# EAGLE design Hardware_v3 (EAGLE 9.3.1)
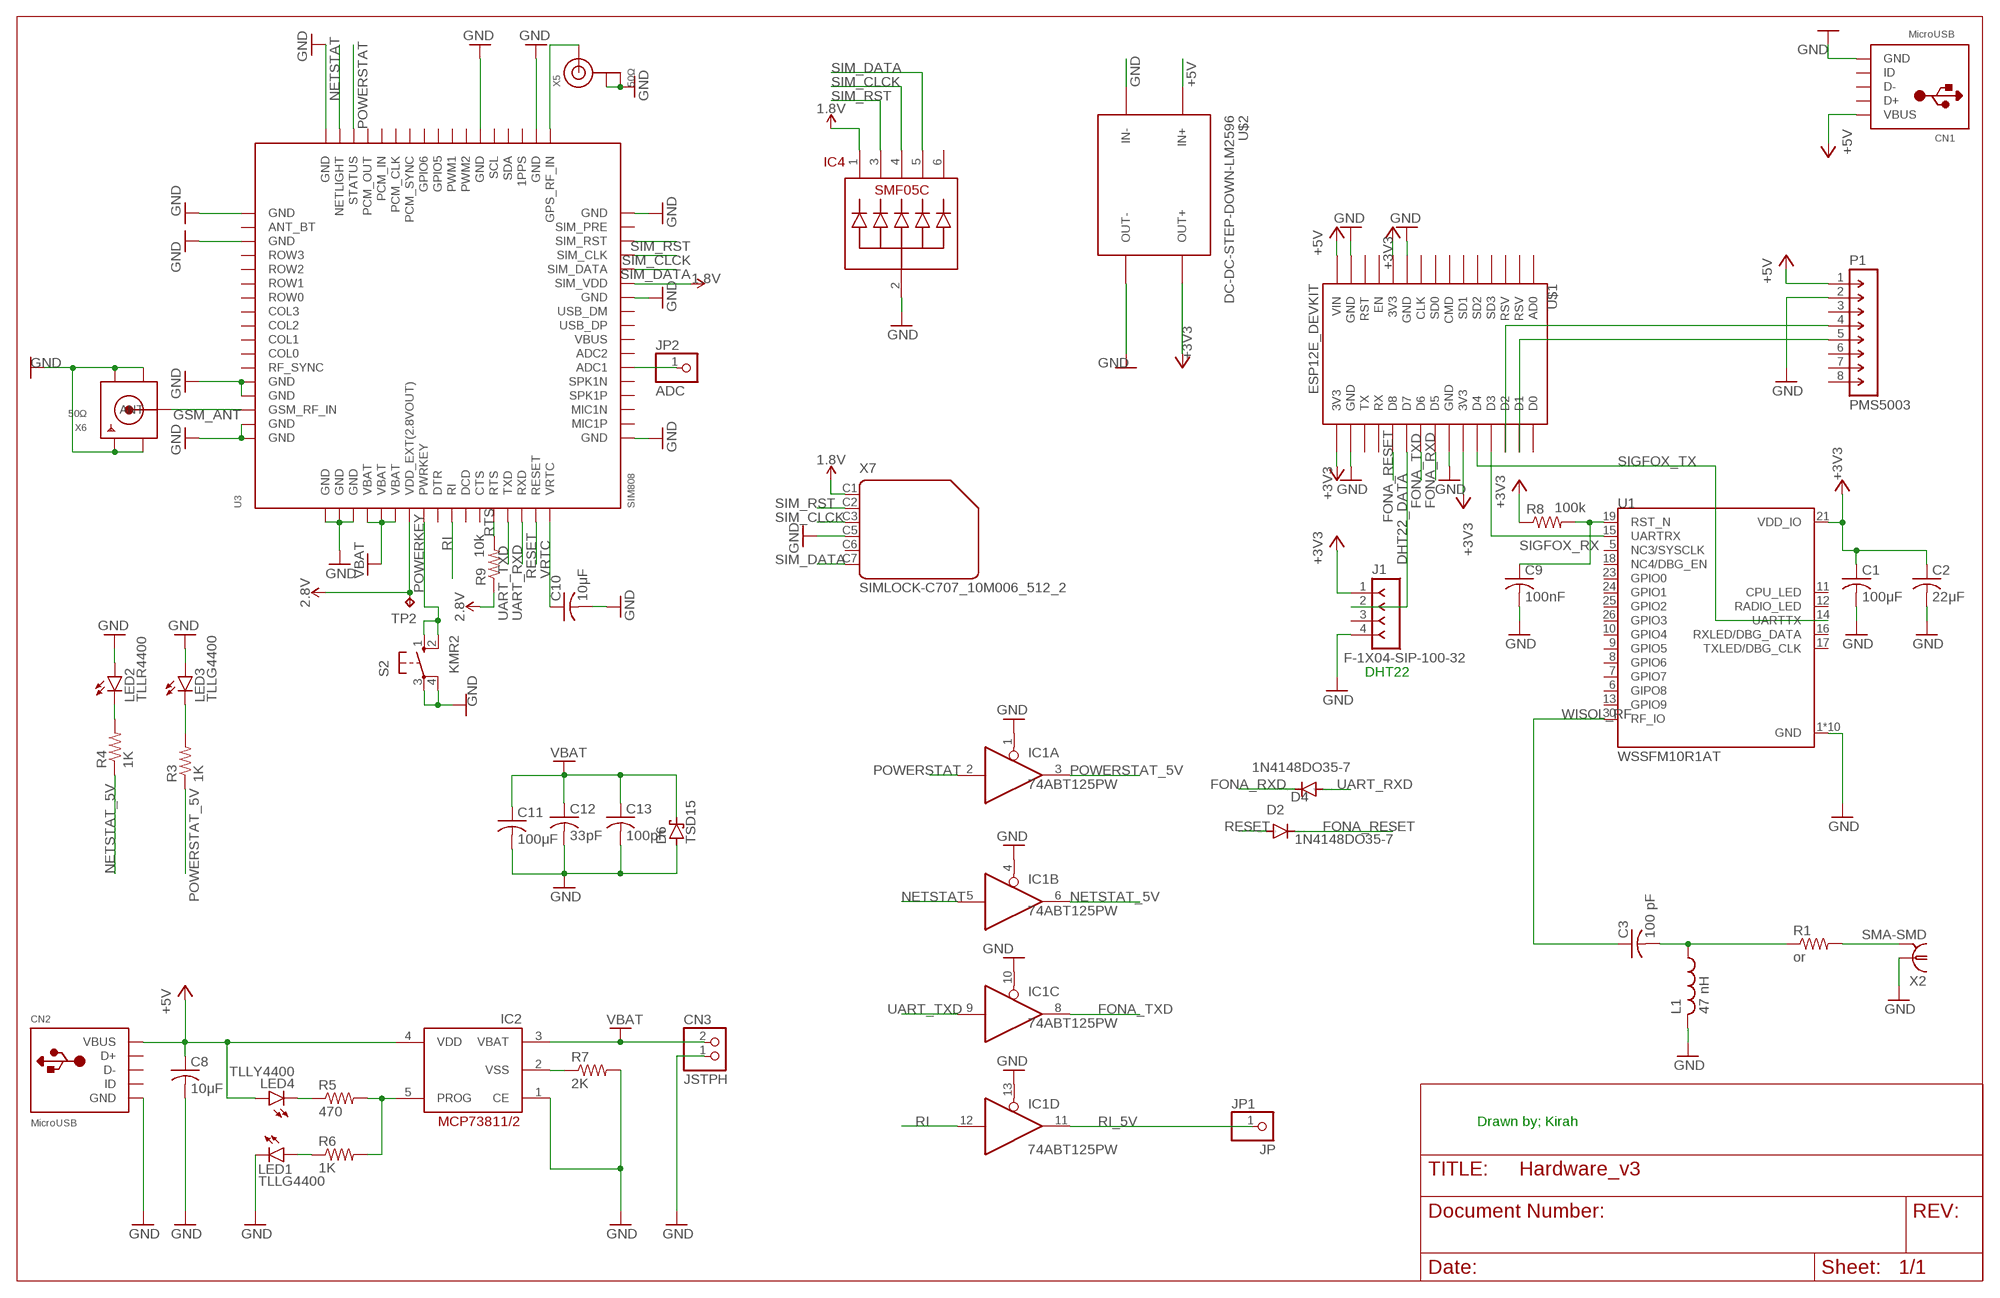
[diagram p0: schematic, sheet 1]

## Parts
C1  100μF  C-USC0201  [C0201]
C2  22μF  C-USC0201  [C0201]
C3  100 pF  C-USC0201  [C0201]
C8  10μF  C-US025-025X050  [C025-025X050]
C9  100nF  C-US025-025X050  [C025-025X050]
C10  10μF  C-USC0402  [C0402]
C11  100μF  C-USC0402  [C0402]
C12  33pF  C-USC0402  [C0402]
C13  100pF  C-USC0402  [C0402]
CN1  MicroUSB  USBMINIB  [USB-MINIB]
CN2  MicroUSB  USBMINIB  [USB-MINIB]
CN3  JSTPH  JST_2PIN-SMT  [JST-PH-2-SMT]
D2  1N4148DO35-7  [DO35-7]
D4  1N4148DO35-7  [DO35-7]
D6  TSD15  [CB429-15]
IC1  74ABT125PW  [TSSOP14]
IC2  MCP73811/2  [SOT23-5L]
IC4  SMF05C  [SC-70-6]
J1  F-1X04-SIP-100-32  [SIP-100-04-32]
JP1  JP  PINHD-1X1CB  [1X01-CLEANBIG]
JP2  ADC  PINHD-1X01_2.00  [1X01M]
L1  47 nH  L-US0204/7  [0204/7]
LED1  TLLG4400  [LED3MM]
LED2  TLLR4400  [LED3MM]
LED3  TLLG4400  [LED3MM]
LED4  TLLY4400  [LED3MM]
P1  PMS5003  M-1X08-SIP-100-40  [SIP-100-08-40]
R1  or  R-US_0204/5  [0204/5]
R3  1K  R-US_0204/5  [0204/5]
R4  1K  R-US_0204/5  [0204/5]
R5  470  R-US_0204/5  [0204/5]
R6  1K  R-US_0204/5  [0204/5]
R7  2K  R-US_0204/5  [0204/5]
R8  100k  R-US_0204/7  [0204/7]
R9  10k  R-US_0204/5  [0204/5]
S2  KMR2  40/XX  [B3F/40XX]
TP2  TPTP10R  [TP10R]
U1  WSSFM10R1AT  [XCVR_WSSFM10R1AT]
U3  SIM808  GSM_SIM808_LITERAL  [SIM900_SMT]
U$1  ESP12E_DEVKIT  [ESP12E_DEVKIT]
U$2  DC-DC-STEP-DOWN-LM2596  [DC-DC-STEP-DOWN-LM2596]
X2  SMA-SMD  [SMA-SMD]
X5  50Ω  ANTENNA_U.FL  [U.FL]
X6  50Ω  SMACONNECTOR_EDGE_UFL  [SMA_EDGELAUNCH_UFL]
X7  SIMLOCK-C707_10M006_512_2  [C707_10M006_512_2]

## Nets
1.8V [POWER]: IC4.1 U3.P$29(SIM_VDD) X7.C1
2.8V [POWER]: R9.1 TP2.TP U3.P$7(VDD_EXT(2.8VOUT))
+3V3 [POWER]: C1.1 C2.1 J1.1 R8.1 U1.21(VDD_IO) U$1.3V3@0(3V3) U$1.3V3@1(3V3) U$1.3V3@2(3V3) U$2.OUT+
+5V [POWER]: C8.1 CN1.VBUS CN2.VBUS IC2.4(VDD) LED4.A P1.1 U$1.VIN U$2.IN+
DHT22_DATA: J1.2 U$1.D7
FONA_RESET: D2.C U$1.D8
FONA_RXD: D4.C U$1.D5
FONA_TXD: IC1.8(C:O) U$1.D6
GND [GND]: C1.2 C2.2 C8.2 C9.2 C10.2 C11.2 C12.2 C13.2 CN1.GND CN2.GND CN3.1 D6.A IC1.1(A:OE) IC1.4(B:OE) IC1.10(C:OE) IC1.13(D:OE) IC2.1(CE) IC4.2 J1.4 L1.2 LED1.K(C) LED2.A LED3.A P1.2 R7.2 S2.3(P) S2.4(P1) U1.1(GND) U1.2(GND) U1.3(GND) U1.4(GND) U1.20(GND) U1.22(GND) U1.27(GND) U1.28(GND) U1.29(GND) U1.31(GND) U3.P$1(GND) U3.P$2(GND) U3.P$3(GND) U3.P$18(GND) U3.P$28(GND) U3.P$34(GND) U3.P$36(GND) U3.P$40(GND) U3.P$51(GND) U3.P$52(GND) U3.P$54(GND) U3.P$64(GND) U3.P$65(GND) U3.P$67(GND) U3.P$68(GND) U$1.GND@0(GND) U$1.GND@1(GND) U$1.GND@2(GND) U$1.GND@3(GND) U$2.IN- U$2.OUT- X2.1 X5.1(GND) X5.2(GND) X6.GND@1(GND1) X6.GND@2(GND2) X6.GND@3(GND3) X6.GND@4(GND4) X7.C5
GSM_ANT: U3.P$66(GSM_RF_IN) X6.P(ANT)
N$2: C9.1 R8.2 U1.19(RST_N)
N$3: P1.4 U$1.D2
N$4: P1.5 U$1.D1
N$5: C3.2 L1.1 R1.1
N$6: U3.P$35(GPS_RF_IN) X5.3(SIGNAL)
N$12: R1.2 X2.2@1 X2.2@2 X2.2@3 X2.2@4 X2.2@5 X2.2@6
N$13: JP2.1 U3.P$23(ADC1)
N$18: LED2.K(C) R4.2
N$21: LED3.K(C) R3.2
N$35: LED4.K(C) R5.1
N$36: IC2.5(PROG) R5.2 R6.2
N$37: LED1.A R6.1
NETSTAT: IC1.5(B:I) U3.P$50(NETLIGHT)
NETSTAT_5V: IC1.6(B:O) R4.1
POWERKEY: S2.1(S) S2.2(S1) U3.P$8(PWRKEY)
POWERSTAT: IC1.2(A:I) U3.P$49(STATUS)
POWERSTAT_5V: IC1.3(A:O) R3.1
RESET: D2.A U3.P$16(RESET)
RI: IC1.12(D:I) U3.P$10(RI)
RI_5V: IC1.11(D:O) JP1.1
RTS: R9.2 U3.P$13(RTS)
SIGFOX_RX: U1.15(UARTRX) U$1.D3
SIGFOX_TX: U1.14(UARTTX) U$1.D4
SIM_CLCK: IC4.4 U3.P$31(SIM_CLK) X7.C3
SIM_DATA: IC4.5 U3.P$30(SIM_DATA) X7.C7
SIM_RST: IC4.3 U3.P$32(SIM_RST) X7.C2
UART_RXD: D4.A U3.P$15(RXD)
UART_TXD: IC1.9(C:I) U3.P$14(TXD)
VBAT: C11.1 C12.1 C13.1 CN3.2 D6.C IC2.3(VBAT) U3.P$4(VBAT) U3.P$5(VBAT) U3.P$6(VBAT)
VRTC: C10.1 U3.P$17(VRTC)
VSS: IC2.2(VSS) R7.1
WISOL_RF: C3.1 U1.30(RF_IO)
Unconnected: CN1.D+ CN1.D- CN1.ID CN2.D+ CN2.D- CN2.ID IC4.6 J1.3 P1.3 P1.6 P1.7 P1.8 U1.5(NC3/SYSCLK) U1.6(GIPO8) U1.7(GPIO7) U1.8(GPIO6) U1.9(GPIO5) U1.10(GPIO4) U1.11(CPU_LED) U1.12(RADIO_LED) U1.13(GPIO9) U1.16(RXLED/DBG_DATA) U1.17(TXLED/DBG_CLK) U1.18(NC4/DBG_EN) U1.23(GPIO0) U1.24(GPIO1) U1.25(GPIO2) U1.26(GPIO3) U3.P$9(DTR) U3.P$11(DCD) U3.P$12(CTS) U3.P$19(MIC1P) U3.P$20(MIC1N) U3.P$21(SPK1P) U3.P$22(SPK1N) U3.P$24(ADC2) U3.P$26(USB_DP) U3.P$27(USB_DM) U3.P$33(SIM_PRE) U3.P$37(1PPS) U3.P$38(SDA) U3.P$39(SCL) U3.P$41(PWM2) U3.P$42(PWM1) U3.P$43(GPIO5) U3.P$44(GPIO6) U3.P$45(PCM_SYNC) U3.P$46(PCM_CLK) U3.P$47(PCM_IN) U3.P$48(PCM_OUT) U3.P$53(ANT_BT) U3.P$55(ROW3) U3.P$56(ROW2) U3.P$57(ROW1) U3.P$58(ROW0) U3.P$59(COL3) U3.P$60(COL2) U3.P$61(COL1) U3.P$62(COL0) U3.P$63(RF_SYNC) U$1.AD0 U$1.CLK U$1.CMD U$1.D0 U$1.EN U$1.RST U$1.RSV@0(RSV) U$1.RSV@1(RSV) U$1.RX U$1.SD0 U$1.SD1 U$1.SD2 U$1.SD3 U$1.TX X7.C6

## Notes on the sheet
- DHT22
- Drawn by; Kirah

## Power pins joined to a net without a drawn wire
GND: IC1.7(P:GND)
VBUS: U3.P$25(VBUS)
VCC: IC1.14(P:VCC)

## Library data of the parts
C1-C3 C9-C13 = rcl:C-US: CAPACITOR, American symbol; SPICEPREFIX: C
C8 = adafruit@1:C-US: CAPACITOR, American symbol
CN1 = adafruit:USB: USB Connectors USBMINIB - Surface Mount Female Mini-B USB Connector 4UConnector: 06564 By microbuilder.eu Thru-hole RA Female Mini-B USB Connector 4UConnector: 18732 By ladyada.net
CN2 = adafruit@1:USB: USB Connectors USBMINIB - Surface Mount Female Mini-B USB Connector 4UConnector: 06564 By microbuilder.eu Thru-hole RA Female Mini-B USB Connector 4UConnector: 18732 By ladyada.net
CN3 = adafruit:JST_2PIN: JST 2-Pin Connectors of various flavors SMT-RA (S2B-PH-SM4) 4UConnector #17311 SMT (B2B-PH-SM4) THM-RA (S2B-PH) THM (B2B-PH)
D2 D4 = diode:1N4148: DIODE high speed (Philips)
D6 = diode:TSD15: DIODE
IC1 = 74xx-eu:74*125: Quad bus BUFFER, 3-state
IC2 = adafruit:MCP73811/2: MCP73811 and MCP73812 Simple, Miniature Single-Cell, Fully Integrated Li-Ion / Li-Polymer Charge Management Controllers SOT-23-5 package, no indicator LED but with adjustable current, small and very inexpensive
IC4 = smf05c:SMF05C
J1 = con-headers-jp:F-1X04-: FEMALE HEADER
JP1 = adafruit:PINHD-1X1: Pin header 1x1 for 0.1" spacing With round pins
JP2 = pinhead-2:PINHD-1X01: PIN HEADER
L1 = rcl:L-US: INDUCTOR, American symbol; SPICEPREFIX: L
LED1 LED3 = led:TLLG4400: Low Current (2mA) LED 3 mm Tinted Diffused Package color GREEN Source: Data sheet <http://www.farnell.com/datasheets/391098.pdf>; MF: VISHAY SEMICONDUCTOR; OC_FARNELL: 1612435
LED2 = led:TLLR4400: Low Current (2mA) LED 3 mm Tinted Diffused Package color RED Source: Data sheet <http://www.farnell.com/datasheets/391100.pdf>; MF: VISHAY SEMICONDUCTOR; OC_FARNELL: 1612437
LED4 = led:TLLY4400: Low Current (2mA) LED 3 mm Tinted Diffused Package color YELLOW Source: Data sheet <http://www.farnell.com/datasheets/391098.pdf>; MF: VISHAY SEMICONDUCTOR; OC_FARNELL: 1612439
P1 = con-headers-jp:M-1X08-: MALE HEADER
R1 R3-R9 = rcl:R-US_: RESISTOR, American symbol; SPICEPREFIX: R
S2 = switch-omron:40/XX: OMRON SWITCH; OC_FARNELL: unknown; OC_NEWARK: unknown
TP2 = testpad:TP: Test pad
U1 = WSSFM10R1AT:WSSFM10R1AT: Sigfox RF Module, Sub-1GHz , SMD; AVAILABILITY: Unavailable; DESCRIPTION: Sigfox Module Rcz1 At Version; MF: Avnet Design Services; MP: WSSFM10R1AT; PACKAGE: None; PRICE: None
U3 = adafruit:GSM_SIM808_LITERAL: SIM808 GSM Module
U$1 = ESP12E_DEVKIT:ESP12E_DEVKIT: ESP12E DEVKIT BOARD
U$2 = diy-modules:DC-DC-STEP-DOWN-LM2596: DC/DC Step-Down Regulator based on LM2596-ADJ chip LM2596 datasheet available here: http://www.ti.com/lit/ds/symlink/lm2596.pdf Click here to find device on ebay.com <http://www.ebay.com/sch/lm2596+power+regulator>
X2 = con-coax:SMA-SMD: SMA 50 Ohm Straight Jack Receptacle - Surface Mount www.johnsoncomponents.com Source: http://catalog.digikey.com .. 142-0711-201, 205, 202, 206.pdf; OC_FARNELL: unknown; OC_NEWARK: unknown
X5 = adafruit:ANTENNA_U.FL: U.FL Antenna Connector
X6 = adafruit@1:SMACONNECTOR: SMA Connector 90° DIP SMA Connector, 50 Ohm (4UConnector: 07259)
X7 = con-amphenol:SIMLOCK-C707_10M006_512_2: C707A SIMLOCK® 2.5 mm with wide solder tails Source: Data sheet <http://www.amphenol.info/downloads/C707_10M006_512_2.pdf>; OC_FARNELL: unknown; OC_NEWARK: unknown

## Net classes
1 POWER: width 0.305 mm
2 GND: width 0.254 mm

## Board
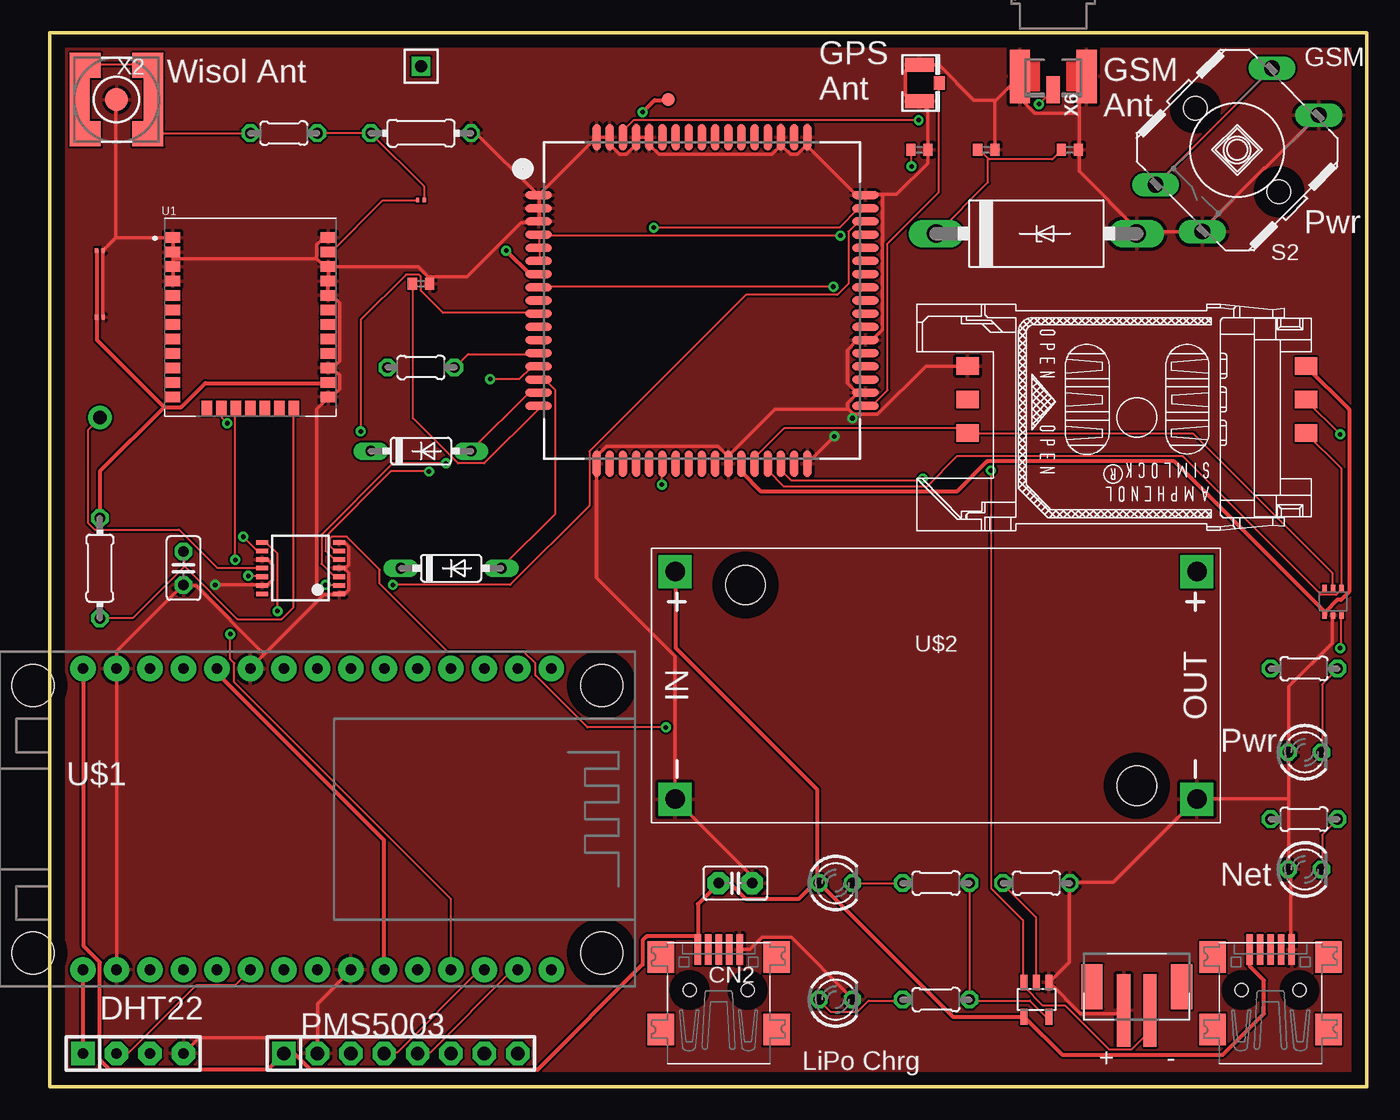
[diagram p1: board, top side]
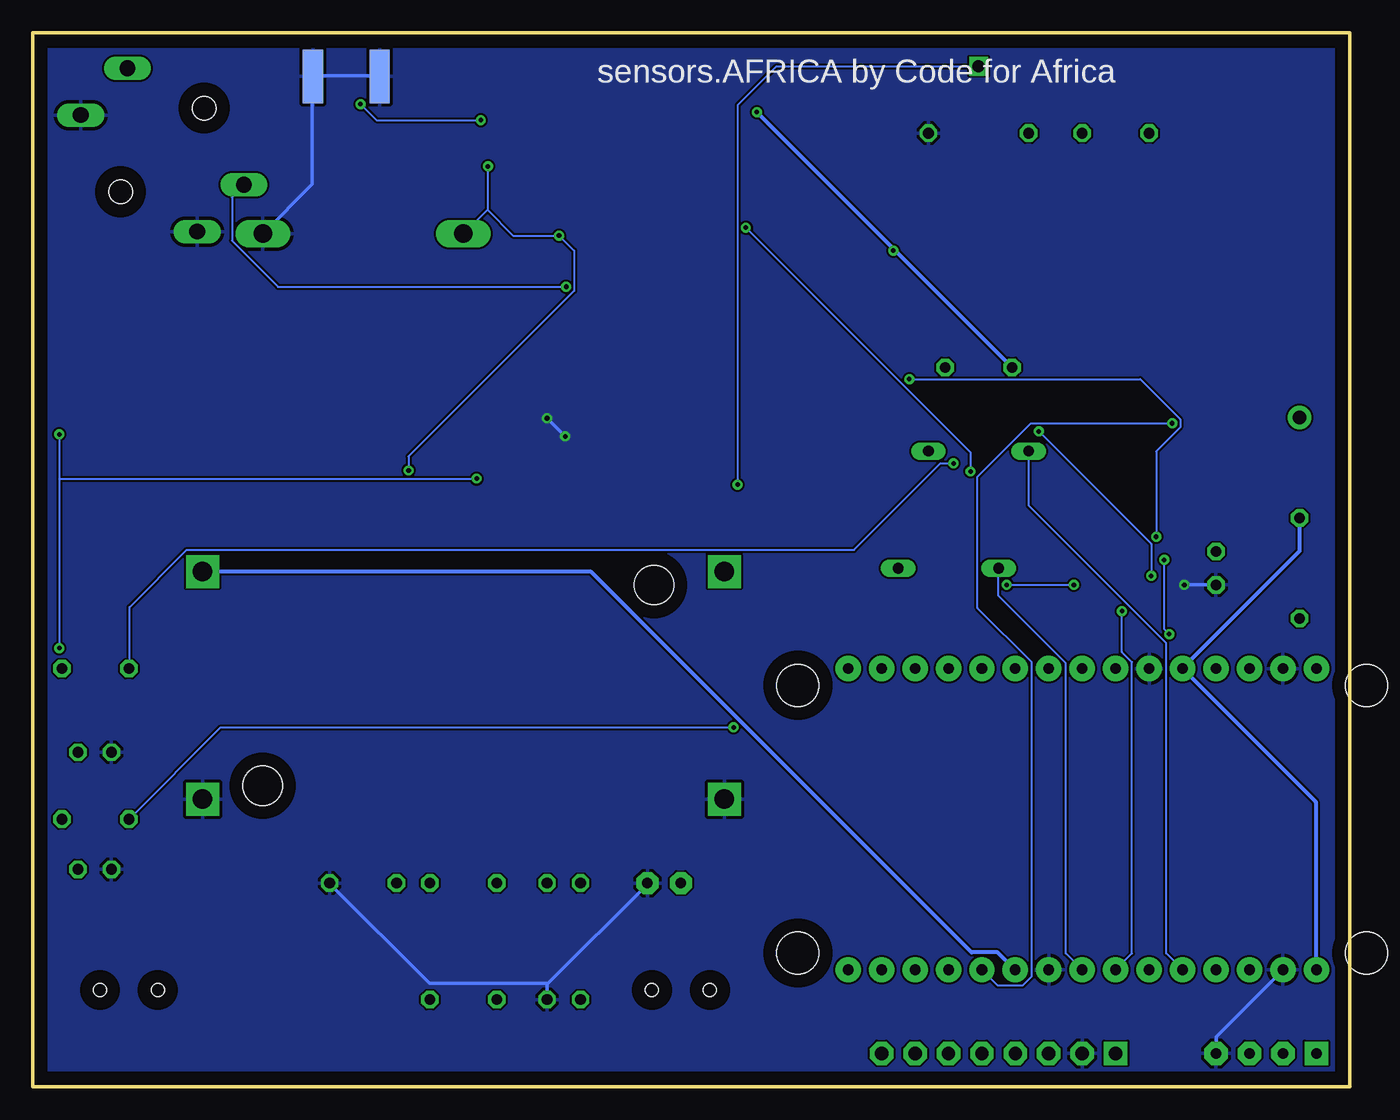
[diagram p2: board, bottom side, seen from below]

Size 100 x 80 mm. Coordinates in mm from the lower left corner, seen from the top.
Outline: 0,0 100,0 100,80 0,80 0,0
Copper layers (1*16): Top 0.035mm / dielectric 1.5mm / Bottom 0.035mm
Design rules "default": minimum track width 6mil, minimum drill 0.35mm, track to track 6mil, track to pad 6mil, pad to pad 6mil, via to via 6mil, smd to smd 6mil, copper to edge 40mil, drill to drill 6mil, minimum pad ring 10mil, minimum via ring 8mil, stop-mask expansion 4mil, vias tented up to drill 0mil, thermal gap 10mil

### Footprints (pad centres in the part's own frame; a part is rotated, then mirrored left to right if it is on the bottom)
C0201 = smd 0.25 x 0.35: 1 -0.25,0; 2 0.25,0
C025-025X050 = drill 0.813 pad 1.676 octagon: 1 -1.27,0; 2 1.27,0
C025-025X050' = drill 0.813 octagon: 1 -1.27,0; 2 1.27,0
C0402 = smd 0.7 x 0.9: 1 -0.65,0; 2 0.65,0
USB-MINIB = smd 0.5 x 2.308: D+ 0,4.064; D- -0.8,4.064; GND 1.6,4.064; ID 0.8,4.064; VBUS -1.6,4.064 | smd 2 x 2.4: GND1 -4.4,-2; GND2 -4.4,3.5; GND3 4.4,3.5; GND4 4.4,-2 | hole 1: -2.2,1; 2.2,1
JST-PH-2-SMT = smd 1 x 5.5: 1 -1,-1.8; 2 1,-1.8 | smd 1.6 x 3.4: NC1 -3.4,0; NC2 3.4,0
DO35-7 = drill 0.813 long: A 3.81,0; C -3.81,0
CB429-15 = drill 1.397 long: A 7.62,0; C -7.62,0
TSSOP14 = smd 0.35 x 0.9: 1 -1.95,-2.925; 2 -1.3,-2.925; 3 -0.65,-2.925; 4 0,-2.925; 5 0.65,-2.925; 6 1.3,-2.925; 7 1.95,-2.925; 8 1.95,2.925; 9 1.3,2.925; 10 0.65,2.925; 11 0,2.925; 12 -0.65,2.925; 13 -1.3,2.925; 14 -1.95,2.925
SOT23-5L = smd 0.55 x 1.2: 1 -0.95,-1.3; 2 0,-1.3; 3 0.95,-1.3; 4 0.95,1.3; 5 -0.95,1.3
SC-70-6 = smd 0.35 x 0.5: 1 -0.65,-1.05; 2 0,-1.05; 3 0.65,-1.05; 4 0.65,1.05; 5 0,1.05; 6 -0.65,1.05
SIP-100-04-32 = drill 0.813 pad 1.778 square: 1 -3.81,0 | drill 0.813 pad 1.778 octagon: 2 -1.27,0; 3 1.27,0; 4 3.81,0
1X01-CLEANBIG = drill 1.016 pad 1.778: 1 0,0
1X01M = drill 0.914 square: 1 0,0
0204/7 = drill 0.813 octagon: 1 -3.81,0; 2 3.81,0
LED3MM = drill 0.813 octagon: A -1.27,0; K 1.27,0
SIP-100-08-40 = drill 1.016 pad 1.778 square: 1 -8.89,0 | drill 1.016 pad 1.778 octagon: 2 -6.35,0; 3 -3.81,0; 4 -1.27,0; 5 1.27,0; 6 3.81,0; 7 6.35,0; 8 8.89,0
0204/5 = drill 0.813 octagon: 1 -2.54,0; 2 2.54,0
B3F/40XX = drill 1.194 long: 1 -6.198,-2.642; 2 2.642,6.198; 3 -2.642,-6.198; 4 6.198,2.642 | hole 1.803: -3.175,3.175; 3.175,-3.175
TP10R = smd 1 x 1: TP 0,0
XCVR_WSSFM10R1AT = smd 1.15 x 0.81: 1 -5.9,6.05; 2 -5.9,4.95; 3 -5.9,3.85; 4 -5.9,2.75; 5 -5.9,1.65; 6 -5.9,0.55; 7 -5.9,-0.55; 8 -5.9,-1.65; 9 -5.9,-2.75; 10 -5.9,-3.85; 11 -5.9,-4.95; 12 -5.9,-6.05; 20 5.9,-6.05; 21 5.9,-4.95; 22 5.9,-3.85; 23 5.9,-2.75; 24 5.9,-1.65; 25 5.9,-0.55; 26 5.9,0.55; 27 5.9,1.65; 28 5.9,2.75; 29 5.9,3.85; 30 5.9,4.95; 31 5.9,6.05 | smd 0.81 x 1.15: 13 -3.3,-6.9; 14 -2.2,-6.9; 15 -1.1,-6.9; 16 0,-6.9; 17 1.1,-6.9; 18 2.2,-6.9; 19 3.3,-6.9
SIM900_SMT = smd 2 x 0.6: P$1 -12.4,8; P$2 -12.4,7; P$3 -12.4,6; P$4 -12.4,5; P$5 -12.4,4; P$6 -12.4,3; P$7 -12.4,2; P$8 -12.4,1; P$9 -12.4,0; P$10 -12.4,-1; P$11 -12.4,-2; P$12 -12.4,-3; P$13 -12.4,-4; P$14 -12.4,-5; P$15 -12.4,-6; P$16 -12.4,-7; P$17 -12.4,-8; P$35 12.4,-8; P$36 12.4,-7; P$37 12.4,-6; P$38 12.4,-5; P$39 12.4,-4; P$40 12.4,-3; P$41 12.4,-2; P$42 12.4,-1; P$43 12.4,0; P$44 12.4,1; P$45 12.4,2; P$46 12.4,3; P$47 12.4,4; P$48 12.4,5; P$49 12.4,6; P$50 12.4,7; P$51 12.4,8 | smd 0.6 x 2: P$18 -8,-12.4; P$19 -7,-12.4; P$20 -6,-12.4; P$21 -5,-12.4; P$22 -4,-12.4; P$23 -3,-12.4; P$24 -2,-12.4; P$25 -1,-12.4; P$26 0,-12.4; P$27 1,-12.4; P$28 2,-12.4; P$29 3,-12.4; P$30 4,-12.4; P$31 5,-12.4; P$32 6,-12.4; P$33 7,-12.4; P$34 8,-12.4; P$52 8,12.4; P$53 7,12.4; P$54 6,12.4; P$55 5,12.4; P$56 4,12.4; P$57 3,12.4; P$58 2,12.4; P$59 1,12.4; P$60 0,12.4; P$61 -1,12.4; P$62 -2,12.4; P$63 -3,12.4; P$64 -4,12.4; P$65 -5,12.4; P$66 -6,12.4; P$67 -7,12.4; P$68 -8,12.4
ESP12E_DEVKIT = drill 0.8 pad 1.93: 3V3@0 -11.43,-7.62; 3V3@1 11.43,5.08; 3V3@2 11.43,-17.78; AD0 -11.43,17.78; CLK -11.43,-2.54; CMD -11.43,2.54; D0 11.43,17.78; D1 11.43,15.24; D2 11.43,12.7; D3 11.43,10.16; D4 11.43,7.62; D5 11.43,0; D6 11.43,-2.54; D7 11.43,-5.08; D8 11.43,-7.62; EN -11.43,-10.16; GND@0 -11.43,-5.08; GND@1 -11.43,-15.24; GND@2 11.43,2.54; GND@3 11.43,-15.24; RST -11.43,-12.7; RSV@0 -11.43,15.24; RSV@1 -11.43,12.7; RX 11.43,-10.16; SD0 -11.43,0; SD1 -11.43,5.08; SD2 -11.43,7.62; SD3 -11.43,10.16; TX 11.43,-12.7; VIN -11.43,-17.78 | hole 3.2: -10.16,21.59; 10.16,21.59; 10.16,-21.59; -10.16,-21.59
DC-DC-STEP-DOWN-LM2596 = drill 1.5 pad 2.5 square: IN+ -19.812,8.636; IN- -19.812,-8.636; OUT+ 19.812,8.636; OUT- 19.812,-8.636 | hole 3: -14.478,7.62; 15.24,-7.62
SMA-SMD = smd 1.73 x 1.73: 1 0,0 | smd 2.35 x 1.9: 2@1 -2.375,2.6; 2@2 -2.375,-2.6; 2@3 2.375,-2.6; 2@4 2.375,2.6 | smd 1.5 x 3.4: 2@5 -2.8,0; 2@6 2.8,0
U.FL = smd 2.2 x 1.05: 1 0,1.375; 2 0,-1.375 | smd 0.8 x 1: 3 1.525,0
SMA_EDGELAUNCH_UFL = smd 4.064 x 1.524: GND@1 2.032,-2.54; GND@2 2.032,2.54 | smd 4.064 x 1.524 bottom: GND@3 2.032,2.54; GND@4 2.032,-2.54 | smd 2.032 x 1.016: P 3.048,0
C707_10M006_512_2 = smd 1.7 x 1.3: C1 -12.85,-3.915; C2 -12.85,-1.375; C3 -12.85,1.165; C5 12.85,-3.915; C6 12.85,-1.375; C7 12.85,1.165

### Placement (x,y rotation side)
C1  3.81,63.5 0 top
C2  3.81,58.42 0 top
C3  28.19,67.31 0 top
C8  52.07,15.47 0 top
C9  100nF  [C025-025X050']  10.16,39.37 270 top
C10  28.19,60.96 0 top
C11  66.04,71.12 0 top
C12  71.12,71.12 0 top
C13  77.47,71.12 0 top
CN1  92.71,6.35 0 top
CN2  50.8,6.35 0 top
CN3  82.55,7.6 0 top
D2  28.19,48.26 0 top
D4  30.48,39.37 0 top
D6  74.93,64.77 0 top
IC1  19.05,39.37 90 top
IC2  74.93,6.63 180 top
IC4  97.45,36.83 0 top
J1  6.35,2.54 0 top
JP1  3.81,50.8 0 top
JP2  28.19,77.47 0 top
L1  28.19,72.39 0 top
LED1  59.69,6.63 0 top
LED2  95.31,16.51 0 top
LED3  95.31,25.4 0 top
LED4  59.69,15.47 0 top
P1  26.67,2.54 0 top
R1  17.78,72.39 180 top
R3  95.25,31.75 0 top
R4  95.25,20.32 0 top
R5  67.31,15.47 0 top
R6  67.31,6.63 0 top
R7  74.93,15.47 0 top
R8  3.81,39.37 270 top
R9  28.19,54.61 0 top
S2  90.17,71.12 0 top
TP2  46.99,74.93 0 top
U1  15.24,58.42 0 top
U3  49.53,59.69 0 top
U$1  20.32,20.32 270 top
U$2  67.31,30.48 0 top
X2  5.08,74.93 0 top
X5  66.04,76.2 0 top
X6  76.2,78.74 270 top
X7  82.55,50.8 180 top

### Tracks (layer width: path | path; a pad name or v marks a point on that pad's centre or on a via)
1.8V
  Top 0.305: 96.85,36.04 96.85,35.81 IC4.1 | 96.85,36.04 97.77,36.96 98.07,36.96 98.68,37.57 98.68,51.44 X7.C1 | 96.85,36.04 85.42,47.47 71.17,47.47 68.89,45.19 54.03,45.19 52.58,46.63 52.58,47.24 U3.P$29
2.8V  (via drill 0.35)
  Top 0.305: v45.03,73.99 45.95,74.91 46.94,74.91 TP2.TP | v34.67,63.48 36.42,61.72 37.11,61.72 U3.P$7
  Bottom 0.305: R9.1 34.59,63.55 | 34.59,63.55 v45.03,73.99 | v34.67,63.48 34.59,63.55
+3V3
  Top 0.305: C1.1 3.58,63.48 3.58,58.45 C2.1 3.58,58.29 3.58,56.69 8.69,51.59 | 8.69,51.59 9.98,51.59 11.81,53.42 21.11,53.42 U1.21 | R8.1 3.81,46.71 8.69,51.59 | J1.1 2.52,2.59 2.52,8.84 U$1.3V3@2 | U$1.3V3@1 25.38,8.91 25.38,18.75 12.72,31.39 12.72,31.7 U$1.3V3@0
  Bottom 0.305: U$2.OUT+ 87.1,39.09 57.61,39.09 28.73,10.21 26.75,10.21 25.45,8.91 U$1.3V3@1 | U$1.3V3@2 2.59,8.91 2.59,21.64 U$1.3V3@0 12.65,31.85 3.81,40.69 R8.1
+5V
  Top 0.305: U$1.VIN 2.59,31.7 2.59,10.67 3.81,9.45 3.81,2.06 4.57,1.29 16.54,1.29 P1.1 17.83,2.52 18.59,2.52 19.81,1.29 37.03,1.29 45.03,9.3 45.03,11.12 45.34,11.43 49.15,11.43 CN2.VBUS 49.23,10.44 49.23,13.87 50.75,15.39 C8.1 50.9,15.39 51.74,15.39 52.88,14.25 56.84,14.25 58.14,15.54 LED4.A | LED4.A 58.45,15.47 68.58,5.33 73.91,5.33 IC2.4 74.07,5.26 76.89,2.44 89.08,2.44 92.2,5.56 92.2,8.08 91.14,9.14 91.14,10.36 CN1.VBUS | U$2.IN+ 47.55,39.09 47.55,33.3 58.29,22.55 58.29,15.54 LED4.A
DHT22_DATA
  Top 0.152: J1.2 5.11,2.59 6.02,2.59 11.12,7.7 14.1,7.7 15.24,8.84 U$1.D7
FONA_RESET
  Bottom 0.152: D2.C 24.38,44.12 13.95,33.68 13.95,10.13 U$1.D8
FONA_RXD
  Bottom 0.152: D4.C 26.67,37.26 21.57,32.16 21.57,10.13 U$1.D5
FONA_TXD  (via drill 0.35)
  Top 0.152: v17.3,36.12 17.3,40.46 16.46,41.3 16.15,41.3 IC1.8
  Bottom 0.152: v17.3,36.12 17.3,32.99 16.54,32.23 16.54,10.13 U$1.D6
GND  (via drill 0.35)
  Top 0.254: 20.34,3.73 20.34,6.33 22.86,8.84 U$1.GND@2 | 20.34,3.73 20.34,2.59 P1.2 | 20.34,3.73 11.35,3.73 J1.4 | 22.4,39.32 22.71,39.01 22.71,37.72 22.48,37.49 22.02,37.49 IC1.1 21.87,37.34 20.8,37.34 20.73,37.26 | 22.4,39.32 22.02,39.32 IC1.4 | 22.4,39.32 22.71,39.62 22.71,41 22.4,41.3 22.02,41.3 IC1.7 | 16.31,32.84 15.24,31.77 U$1.GND@0 | 16.31,32.84 20.73,37.26 | IC1.10 16.15,40.01 16.54,40.01 16.92,39.62 16.92,38.48 16.54,38.1 16.15,38.1 IC1.13 16,38.1 v12.57,38.1 | 16.31,32.84 11.12,38.02 10.21,38.02 C9.2 10.13,38.1 5.11,33.07 5.11,31.77 U$1.GND@1 5.11,31.7 5.11,8.91 U$1.GND@3 | U1.4 9.37,61.19 9.37,62.26 U1.3 9.37,62.33 9.37,62.87 | 9.37,62.87 9.37,63.32 U1.2 9.37,63.48 9.37,64.47 U1.1 9.22,64.47 5.03,64.47 | C2.2 4.04,58.45 4.04,63.48 C1.2 4.12,63.55 5.03,64.47 | 5.03,64.47 5.03,74.91 X2.1 | 28.8,61.42 28.8,60.96 C10.2 | 28.8,61.42 27.96,62.26 21.18,62.26 U1.29 | 20.27,62.87 20.27,63.93 20.8,64.47 21.11,64.47 U1.31 | 20.27,62.87 20.8,62.33 21.03,62.33 U1.29 | U1.29 21.18,62.18 21.18,61.27 U1.28 21.11,61.11 21.11,60.12 U1.27 21.26,60.05 21.49,60.05 22.02,59.51 22.02,55.09 21.57,54.63 U1.22 21.18,54.56 21.49,54.56 22.02,54.03 22.02,52.96 21.49,52.43 21.18,52.43 U1.20 21.11,52.27 20.27,51.44 20.27,37.72 20.73,37.26 | U3.P$1 37.19,67.67 37.19,66.75 U3.P$2 37.19,66.67 37.19,65.76 U3.P$3 37.03,65.61 35.81,65.61 31.7,61.49 28.88,61.49 28.8,61.42 | L1.2 32.38,72.39 37.03,67.74 U3.P$1 | U3.P$1 37.19,67.74 41.45,72.01 U3.P$68 41.6,72.08 U3.P$67 42.6,72.01 42.6,71.48 43.28,70.79 43.81,70.79 44.5,71.48 44.5,72.01 U3.P$65 44.58,72.08 45.49,72.08 U3.P$64 45.57,72.01 45.57,71.48 46.25,70.79 54.86,70.79 55.47,71.4 U3.P$54 55.55,72.08 55.55,71.48 56.24,70.79 56.77,70.79 57.45,71.48 57.45,72.08 U3.P$52 57.53,71.4 61.19,67.74 61.87,67.74 U3.P$51 62.03,67.74 63.25,67.74
  Top 0.254: 20.27,62.87 9.37,62.87 | LED1.K 60.96,6.71 56.31,11.35 54.1,11.35 53.19,10.44 52.43,10.44 CN2.GND | C8.2 53.34,16 U$2.IN- 47.47,21.95 47.47,32.69 41.53,38.63 41.53,47.17 U3.P$18 41.6,47.32 41.6,47.93 42.29,48.62 50.75,48.62 51.51,47.85 51.51,47.32 U3.P$28 51.59,47.93 55.09,51.44 60.5,51.44 60.58,51.51 | C8.2 | CN3.1 81.53,5.79 81.31,5.56 78.26,5.56 75.89,7.92 IC2.1 75.97,8 77.42,9.45 77.42,15.39 R7.2 77.57,15.54 80.77,15.54 87.02,21.79 U$2.OUT- 87.17,21.87 94.11,21.87 | CN1.GND 94.26,10.44 94.26,16.31 94.11,16.46 LED2.A 94.11,16.61 94.11,21.87 | IC4.2 97.38,35.74 97.38,33.68 94.11,30.4 94.11,25.45 LED3.A 94.11,25.3 94.11,21.87 | 61.04,51.05 62.87,51.05 66.52,54.71 69.65,54.71 X7.C5 | 60.58,51.51 61.04,51.05 | 60.58,51.51 60.58,51.89 61.34,52.65 61.87,52.65 U3.P$36 61.27,52.73 60.58,53.42 60.58,55.93 61.27,56.62 61.87,56.62 U3.P$40 62.03,56.77 62.56,56.77 63.25,57.45 63.25,67.74 | v59.59,49.38 57.53,47.32 U3.P$34 | v60.96,50.75 60.96,50.98 61.04,51.05 | 78.18,73.91 78.18,76.12 78.72,76.66 X6.GND@3 | 78.18,73.91 78.18,71.17 C13.2 78.18,71.02 78.18,69.49 82.68,65 D6.A 82.6,64.77 82.75,64.92 S2.3 87.48,65 92.2,69.72 92.28,69.72 96.32,73.76 S2.4 | 71.78,74.83 71.78,71.17 C12.2 | 71.78,74.83 X6.GND@4 72.92,75.82 74.83,73.91 78.18,73.91 | 63.25,67.74 64.31,67.74 66.67,70.1 66.67,71.02 C11.2 66.67,71.17 66.67,74.14 66.06,74.75 X5.2 65.91,74.83 65.46,74.83 65,75.29 65,77.11 65.46,77.57 65.99,77.57 X5.1 66.14,77.57 67.51,77.57 70.18,74.91 71.7,74.91 71.78,74.83
  Bottom 0.254: J1.4 10.13,2.59 10.13,3.81 5.11,8.84 U$1.GND@3 | C9.2 v12.57,38.1 | 60.96,7.77 LED1.K | 60.96,7.77 53.34,15.39 C8.2 | 60.96,7.77 61.04,7.85 69.88,7.85 77.42,15.39 R7.2 | v60.96,50.75 v59.59,49.38 | X6.GND@4 73.69,76.73 78.72,76.73 X6.GND@3 78.79,76.66 78.79,68.5 82.53,64.77 D6.A
  pour Top: 0,0 0,80.01 100.33,80.01 100.33,0
  pour Bottom: 0,0 0,80.01 100.33,80.01 100.33,0
GSM_ANT  (via drill 0.35)
  Top 0.152: v65.99,73.38 44.35,73.38 43.59,72.62 43.59,72.16 U3.P$66 | v75.13,74.6 76.2,75.67 X6.P
  Bottom 0.152: v65.99,73.38 73.91,73.38 v75.13,74.6
N$2
  Top 0.152: 10.25,39.51 10.21,39.55 10.21,40.62 C9.1 | 10.25,39.51 14.25,35.51 17.6,35.51 18.52,36.42 18.52,51.51 U1.19 | 10.25,39.51 6.33,35.59 3.81,35.59 R8.2
N$3
  Top 0.152: P1.4 25.45,2.59 26.36,2.59 32.61,8.84 32.99,8.84 U$1.D2
N$4
  Top 0.152: P1.5 27.96,2.59 28.88,2.59 35.13,8.84 35.51,8.84 U$1.D1
N$5
  Top 0.152: C3.2 28.42,67.36 28.42,68.35 L1.1 R1.1
N$6
  Top 0.152: X5.3 67.51,76.2 67.51,67.89 63.63,64.01 63.63,52.88 62.48,51.74 61.95,51.74 U3.P$35
N$12
  Top 0.152: X2.2@2 2.67,72.39 2.67,74.52 2.29,74.91 X2.2@5 2.29,74.98 2.67,75.36 2.67,77.5 X2.2@1 2.74,77.57 7.39,77.57 X2.2@4 7.47,77.5 7.47,75.36 7.85,74.98 X2.2@6 7.85,74.91 7.47,74.52 7.47,72.39 X2.2@3 7.54,72.39 R1.2
N$13  (via drill 0.35)
  Top 0.152: v46.48,45.72 46.48,47.24 U3.P$23
  Bottom 0.152: v46.48,45.72 46.48,74.52 43.59,77.42 28.19,77.42 JP2.1
N$18
  Top 0.152: LED2.K 96.62,16.54 96.62,19.13 97.77,20.27 R4.2
N$21
  Top 0.152: LED3.K 96.62,25.45 96.62,30.56 97.77,31.7 R3.2
N$35
  Top 0.152: LED4.K R5.1 | R5.1
N$36
  Top 0.152: IC2.5 75.82,5.33 75.67,5.33 74.45,6.55 69.88,6.55 R6.2 69.88,6.63 69.88,15.39 R5.2
N$37
  Top 0.152: R6.1 64.77,6.55 62.18,6.55 61.34,5.71 59.28,5.71 58.45,6.55 LED1.A
NETSTAT  (via drill 0.35)
  Top 0.152: v28.8,46.71 25.91,46.71 20.95,41.76 20.95,40.69 21.57,40.08 21.95,40.08 IC1.5 | v45.87,65.23 59.97,65.23 61.42,66.67 61.87,66.67 U3.P$50
  Bottom 0.152: v28.8,46.71 28.8,48.16 v45.87,65.23
NETSTAT_5V  (via drill 0.35)
  Top 0.152: v46.79,27.28 40.84,27.28 36.88,31.24 36.88,32.16 36.04,32.99 30.25,32.99 25.07,38.18 25.07,39.24 22.55,41.76 21.41,41.76 21.26,41.6 21.26,41.07 21.64,40.69 21.95,40.69 IC1.6
  Bottom 0.152: v46.79,27.28 85.72,27.28 92.66,20.34 R4.1
POWERKEY  (via drill 0.35)
  Top 0.152: v59.51,60.73 37.19,60.73 U3.P$8 | S2.2 92.81,77.27 83.97,68.43 S2.1
  Bottom 0.152: v59.51,60.73 81.38,60.73 84.89,64.24 84.89,67.51 83.97,68.43 S2.1
POWERSTAT  (via drill 0.35)
  Top 0.152: v20.95,38.1 21.95,38.1 IC1.2 | v26.06,38.1 34.98,38.1 41,44.12 41,48.23 52.88,60.12 59.82,60.12 60.66,60.96 60.66,64.92 61.42,65.68 61.87,65.68 U3.P$49
  Bottom 0.152: v26.06,38.1 v20.95,38.1
POWERSTAT_5V  (via drill 0.35)
  Top 0.152: v30.1,47.32 26.06,47.32 20.65,41.91 20.65,39.7 21.57,38.79 21.95,38.79 IC1.3
  Bottom 0.152: v30.1,47.32 31.09,47.32 37.64,40.77 88.32,40.77 92.66,36.42 92.66,31.77 R3.1
RESET
  Top 0.152: U3.P$16 37.11,52.65 36.35,52.65 32,48.31 D2.A
RI  (via drill 0.35)
  Top 0.152: v15.09,38.79 16.08,38.79 IC1.12 | v23.62,49.76 23.62,58.22 27.05,61.65 28.04,61.65 28.19,61.49 28.19,60.43 29.87,58.75 37.11,58.75 U3.P$10
  Bottom 0.152: v15.09,38.79 15.09,41.22 v23.62,49.76
RI_5V
  Top 0.152: IC1.11 16.08,39.4 12.72,39.4 9.83,42.29 3.43,42.29 2.9,42.82 2.9,49.84 3.81,50.75 JP1.1
RTS
  Top 0.152: U3.P$13 37.11,55.63 31.77,55.63 30.79,54.63 R9.2
SIGFOX_RX  (via drill 0.35)
  Top 0.152: v14.1,40.01 14.1,51.51 U1.15 | v13.72,34.37 13.72,32.46 14.02,32.16 14.02,30.71 30.48,14.25 U$1.D3
  Bottom 0.152: v14.1,40.01 14.1,34.75 v13.72,34.37
SIGFOX_TX  (via drill 0.35)
  Top 0.152: v13.49,50.37 13.11,50.75 13.11,51.51 U1.14
  Bottom 0.152: v13.49,50.37 24.23,50.37 28.27,46.33 28.27,36.35 24.16,32.23 24.16,8.38 24.84,7.7 26.75,7.7 U$1.D4
SIM_CLCK
  Top 0.152: X7.C3 95.4,49.61 98.07,46.94 98.07,37.95 IC4.4 98.07,37.87 98.07,37.72 97.69,37.34 96.55,37.34 86.03,47.85 68.89,47.85 66.6,45.57 55.78,45.57 54.56,46.79 54.56,47.24 U3.P$31
SIM_DATA
  Top 0.152: IC4.5 97.38,37.95 97.38,39.01 86.79,49.61 69.72,49.61 X7.C7 69.65,49.68 69.34,49.99 55.78,49.99 53.57,47.78 53.57,47.32 U3.P$30
SIM_RST  (via drill 0.35)
  Top 0.152: v97.99,33.3 98.07,33.38 98.07,35.74 IC4.3 | v97.99,49.53 95.4,52.12 X7.C2 | v66.29,46.18 66.14,46.02 56.31,46.02 55.55,46.79 55.55,47.24 U3.P$32
  Bottom 0.152: v97.99,49.53 97.99,46.18 | 97.99,46.18 v97.99,33.3 | 97.99,46.18 v66.29,46.18
UART_RXD
  Top 0.152: U3.P$15 37.19,53.65 37.64,53.65 38.41,52.88 38.41,43.51 34.29,39.4 D4.A
UART_TXD  (via drill 0.35)
  Top 0.152: v14.71,41.76 15.77,40.69 16.08,40.69 IC1.9 | v33.45,53.72 35.66,53.72 36.58,54.63 37.11,54.63 U3.P$14
  Bottom 0.152: v14.71,41.76 14.71,48.23 12.88,50.06 12.88,50.67 15.93,53.72 v33.45,53.72
VBAT  (via drill 0.35)
  Top 0.152: CN3.2 83.52,5.79 83.52,4.19 82.14,2.82 80.47,2.82 77.11,6.17 75.44,6.17 73.99,7.62 IC2.3 73.91,8 73.91,12.65 71.48,15.09 v71.48,46.79 | 71.28,70.45 71.32,70.41 76.12,70.41 76.81,71.09 C13.1 | 71.28,70.45 70.64,71.09 70.48,71.09 C12.1 | U3.P$6 37.19,62.71 37.19,63.63 U3.P$5 37.19,63.7 37.19,64.62 U3.P$4 37.26,64.62 v60.05,64.62 | v65.46,69.88 65.46,71.09 C11.1 | 71.28,70.45 71.25,70.41 71.25,68.66 67.36,64.77 D6.C
  Bottom 0.152: v65.46,69.88 65.46,66.6 65.49,66.56 | 65.49,66.56 67.28,64.77 D6.C | 65.49,66.56 63.55,64.62 v60.05,64.62 58.9,63.48 58.9,60.43 71.48,47.85 v71.48,46.79
VRTC
  Top 0.152: C10.1 27.58,60.96 27.58,50.75 31.01,47.32 32.99,47.32 37.11,51.44 37.11,51.66 U3.P$17
VSS
  Top 0.152: IC2.2 74.91,8 74.91,12.88 72.39,15.39 R7.1
WISOL_RF
  Top 0.152: C3.1 27.89,67.28 25.3,67.28 21.41,63.4 21.18,63.4 U1.30

### Text on the board
tPlace: GSM | Wisol Ant | GPS / Ant | GSM / Ant | Pwr | Pwr | Net | DHT22 | PMS5003 | LiPo Chrg
bPlace: sensors.AFRICA by Code for Africa